# Altium schematic sheet ASCII_08_FPGA_banks_1_2_3_4.SchDoc: FPGA banks 1, 2, 3, 4
size A3; Organization: Lime Microsystems; Address1: Surrey Tech Centre; Address2: Guildford GU2 7YG; Address3: Surrey; Address4: United Kingdom; Revision: v1.4; SheetNumber: 8; SheetTotal: 15
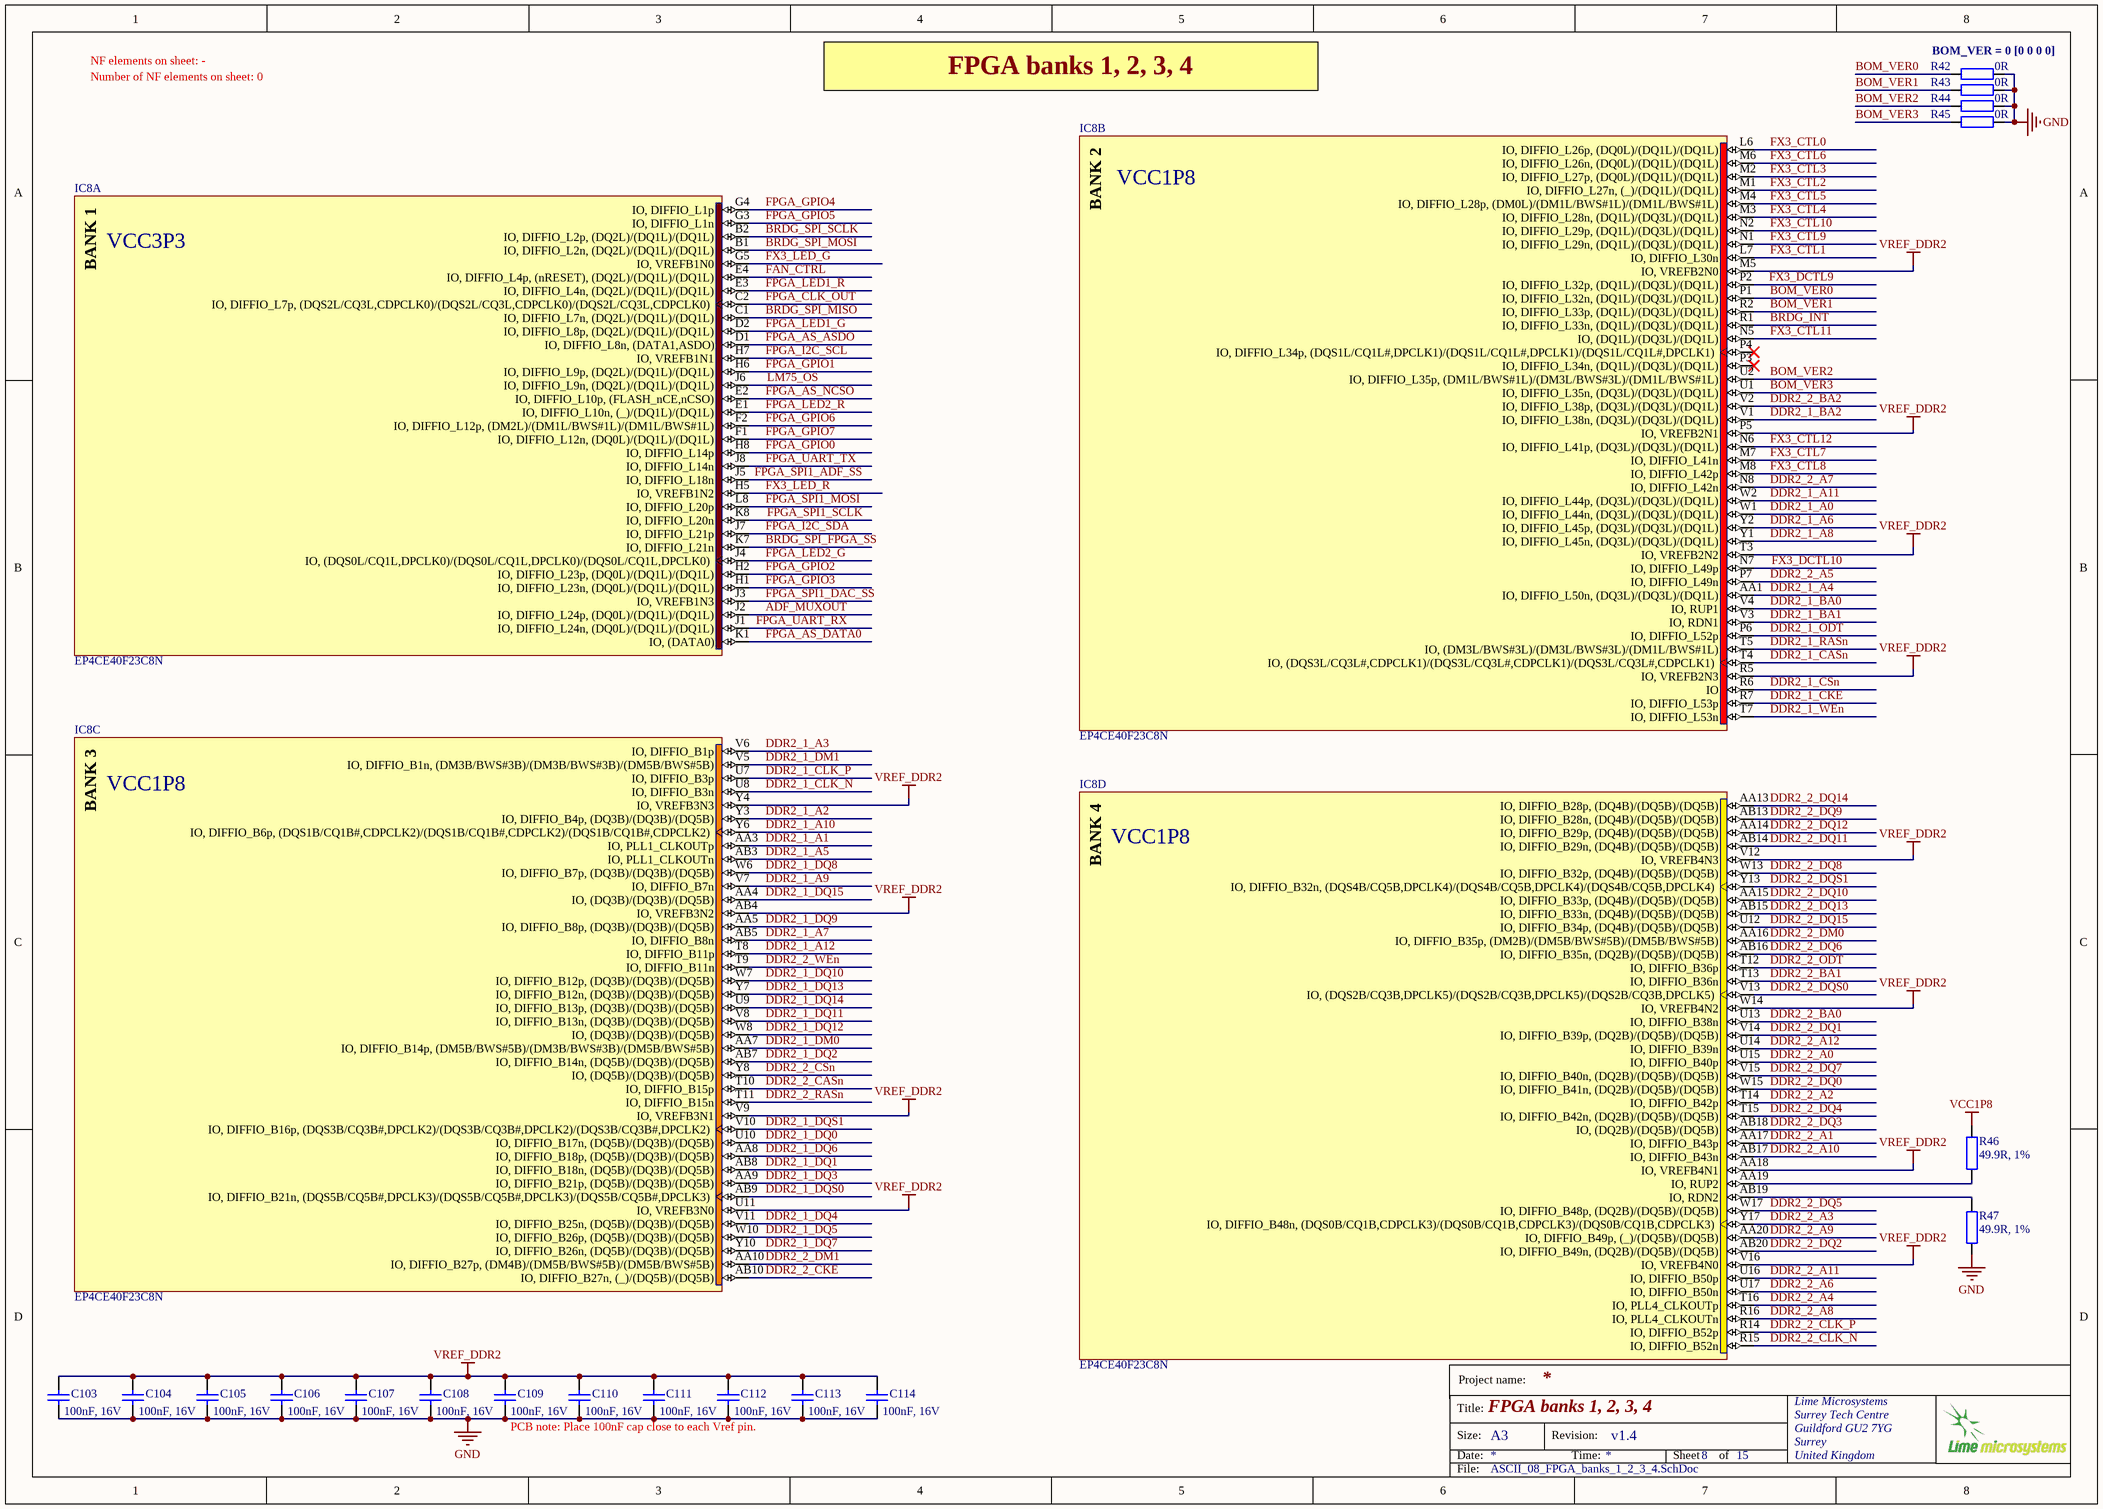
[diagram p0: ASCII_08_FPGA_banks_1_2_3_4.SchDoc]

## Parts
C103  100nF, 16V  [CAP0402]
C104  100nF, 16V  [CAP0402]
C105  100nF, 16V  [CAP0402]
C106  100nF, 16V  [CAP0402]
C107  100nF, 16V  [CAP0402]
C108  100nF, 16V  [CAP0402]
C109  100nF, 16V  [CAP0402]
C110  100nF, 16V  [CAP0402]
C111  100nF, 16V  [CAP0402]
C112  100nF, 16V  [CAP0402]
C113  100nF, 16V  [CAP0402]
C114  100nF, 16V  [CAP0402]
IC8  EP4CE40F23C8N  [FBGA484_A-240]  (parts A,B,C,D of 13)
R42  0R  [RES0402]
R43  0R  [RES0402]
R44  0R  [RES0402]
R45  0R  [RES0402]
R46  49.9R, 1%  [RES0402]
R47  49.9R, 1%  [RES0402]

## Nets
GND: C103.2 C104.2 C105.2 C106.2 C107.2 C108.2 C109.2 C110.2 C111.2 C112.2 C113.2 C114.2 R42.2 R43.2 R44.2 R45.2 R47.1
VCC1P8: R46.2
VREF_DDR2: C103.1 C104.1 C105.1 C106.1 C107.1 C108.1 C109.1 C110.1 C111.1 C112.1 C113.1 C114.1 IC8.AA18(IO,_VREFB4N1) IC8.AB4(IO,_VREFB3N2) IC8.M5(IO,_VREFB2N0) IC8.P5(IO,_VREFB2N1) IC8.R5(IO,_VREFB2N3) IC8.T3(IO,_VREFB2N2) IC8.U11(IO,_VREFB3N0) IC8.V9(IO,_VREFB3N1) IC8.V12(IO,_VREFB4N3) IC8.V16(IO,_VREFB4N0) IC8.W14(IO,_VREFB4N2) IC8.Y4(IO,_VREFB3N3)
ADF_MUXOUT: IC8.J2(IO,_DIFFIO_L24p,_(DQ0L)/(DQ1L)/(DQ1L))
BOM_VER0: IC8.P1(IO,_DIFFIO_L32n,_(DQ1L)/(DQ3L)/(DQ1L)) R42.1
BOM_VER1: IC8.R2(IO,_DIFFIO_L33p,_(DQ1L)/(DQ3L)/(DQ1L)) R43.1
BOM_VER2: IC8.U2(IO,_DIFFIO_L35p,_(DM1L/BWS#1L)/(DM3L/BWS#3L)/(DM1L/BWS#1L)) R44.1
BOM_VER3: IC8.U1(IO,_DIFFIO_L35n,_(DQ3L)/(DQ3L)/(DQ1L)) R45.1
BRDG_INT: IC8.R1(IO,_DIFFIO_L33n,_(DQ1L)/(DQ3L)/(DQ1L))
BRDG_SPI_FPGA_SS: IC8.K7(IO,_DIFFIO_L21n)
BRDG_SPI_MISO: IC8.C1(IO,_DIFFIO_L7n,_(DQ2L)/(DQ1L)/(DQ1L))
BRDG_SPI_MOSI: IC8.B1(IO,_DIFFIO_L2n,_(DQ2L)/(DQ1L)/(DQ1L))
BRDG_SPI_SCLK: IC8.B2(IO,_DIFFIO_L2p,_(DQ2L)/(DQ1L)/(DQ1L))
DDR2_1_A0: IC8.W1(IO,_DIFFIO_L44n,_(DQ3L)/(DQ3L)/(DQ1L))
DDR2_1_A1: IC8.AA3(IO,_PLL1_CLKOUTp)
DDR2_1_A2: IC8.Y3(IO,_DIFFIO_B4p,_(DQ3B)/(DQ3B)/(DQ5B))
DDR2_1_A3: IC8.V6(IO,_DIFFIO_B1p)
DDR2_1_A4: IC8.AA1(IO,_DIFFIO_L50n,_(DQ3L)/(DQ3L)/(DQ1L))
DDR2_1_A5: IC8.AB3(IO,_PLL1_CLKOUTn)
DDR2_1_A6: IC8.Y2(IO,_DIFFIO_L45p,_(DQ3L)/(DQ3L)/(DQ1L))
DDR2_1_A7: IC8.AB5(IO,_DIFFIO_B8n)
DDR2_1_A8: IC8.Y1(IO,_DIFFIO_L45n,_(DQ3L)/(DQ3L)/(DQ1L))
DDR2_1_A9: IC8.V7(IO,_DIFFIO_B7n)
DDR2_1_A10: IC8.Y6(IO,_DIFFIO_B6p,_(DQS1B/CQ1B#,CDPCLK2)/(DQS1B/CQ1B#,CDPCLK2)/(DQS1B/CQ1B#,CDPCLK2))
DDR2_1_A11: IC8.W2(IO,_DIFFIO_L44p,_(DQ3L)/(DQ3L)/(DQ1L))
DDR2_1_A12: IC8.T8(IO,_DIFFIO_B11p)
DDR2_1_BA0: IC8.V4(IO,_RUP1)
DDR2_1_BA1: IC8.V3(IO,_RDN1)
DDR2_1_BA2: IC8.V1(IO,_DIFFIO_L38n,_(DQ3L)/(DQ3L)/(DQ1L))
DDR2_1_CASn: IC8.T4(IO,_(DQS3L/CQ3L#,CDPCLK1)/(DQS3L/CQ3L#,CDPCLK1)/(DQS3L/CQ3L#,CDPCLK1))
DDR2_1_CKE: IC8.R7(IO,_DIFFIO_L53p)
DDR2_1_CLK_N: IC8.U8(IO,_DIFFIO_B3n)
DDR2_1_CLK_P: IC8.U7(IO,_DIFFIO_B3p)
DDR2_1_CSn: IC8.R6(IO)
DDR2_1_DM0: IC8.AA7(IO,_DIFFIO_B14p,_(DM5B/BWS#5B)/(DM3B/BWS#3B)/(DM5B/BWS#5B))
DDR2_1_DM1: IC8.V5(IO,_DIFFIO_B1n,_(DM3B/BWS#3B)/(DM3B/BWS#3B)/(DM5B/BWS#5B))
DDR2_1_DQ0: IC8.U10(IO,_DIFFIO_B17n,_(DQ5B)/(DQ3B)/(DQ5B))
DDR2_1_DQ1: IC8.AB8(IO,_DIFFIO_B18n,_(DQ5B)/(DQ3B)/(DQ5B))
DDR2_1_DQ2: IC8.AB7(IO,_DIFFIO_B14n,_(DQ5B)/(DQ3B)/(DQ5B))
DDR2_1_DQ3: IC8.AA9(IO,_DIFFIO_B21p,_(DQ5B)/(DQ3B)/(DQ5B))
DDR2_1_DQ4: IC8.V11(IO,_DIFFIO_B25n,_(DQ5B)/(DQ3B)/(DQ5B))
DDR2_1_DQ5: IC8.W10(IO,_DIFFIO_B26p,_(DQ5B)/(DQ3B)/(DQ5B))
DDR2_1_DQ6: IC8.AA8(IO,_DIFFIO_B18p,_(DQ5B)/(DQ3B)/(DQ5B))
DDR2_1_DQ7: IC8.Y10(IO,_DIFFIO_B26n,_(DQ5B)/(DQ3B)/(DQ5B))
DDR2_1_DQ8: IC8.W6(IO,_DIFFIO_B7p,_(DQ3B)/(DQ3B)/(DQ5B))
DDR2_1_DQ9: IC8.AA5(IO,_DIFFIO_B8p,_(DQ3B)/(DQ3B)/(DQ5B))
DDR2_1_DQ10: IC8.W7(IO,_DIFFIO_B12p,_(DQ3B)/(DQ3B)/(DQ5B))
DDR2_1_DQ11: IC8.V8(IO,_DIFFIO_B13n,_(DQ3B)/(DQ3B)/(DQ5B))
DDR2_1_DQ12: IC8.W8(IO,_(DQ3B)/(DQ3B)/(DQ5B))
DDR2_1_DQ13: IC8.Y7(IO,_DIFFIO_B12n,_(DQ3B)/(DQ3B)/(DQ5B))
DDR2_1_DQ14: IC8.U9(IO,_DIFFIO_B13p,_(DQ3B)/(DQ3B)/(DQ5B))
DDR2_1_DQ15: IC8.AA4(IO,_(DQ3B)/(DQ3B)/(DQ5B))
DDR2_1_DQS0: IC8.AB9(IO,_DIFFIO_B21n,_(DQS5B/CQ5B#,DPCLK3)/(DQS5B/CQ5B#,DPCLK3)/(DQS5B/CQ5B#,DPCLK3))
DDR2_1_DQS1: IC8.V10(IO,_DIFFIO_B16p,_(DQS3B/CQ3B#,DPCLK2)/(DQS3B/CQ3B#,DPCLK2)/(DQS3B/CQ3B#,DPCLK2))
DDR2_1_ODT: IC8.P6(IO,_DIFFIO_L52p)
DDR2_1_RASn: IC8.T5(IO,_(DM3L/BWS#3L)/(DM3L/BWS#3L)/(DM1L/BWS#1L))
DDR2_1_WEn: IC8.T7(IO,_DIFFIO_L53n)
DDR2_2_A0: IC8.U15(IO,_DIFFIO_B40p)
DDR2_2_A1: IC8.AA17(IO,_DIFFIO_B43p)
DDR2_2_A2: IC8.T14(IO,_DIFFIO_B42p)
DDR2_2_A3: IC8.Y17(IO,_DIFFIO_B48n,_(DQS0B/CQ1B,CDPCLK3)/(DQS0B/CQ1B,CDPCLK3)/(DQS0B/CQ1B,CDPCLK3))
DDR2_2_A4: IC8.T16(IO,_PLL4_CLKOUTp)
DDR2_2_A5: IC8.P7(IO,_DIFFIO_L49n)
DDR2_2_A6: IC8.U17(IO,_DIFFIO_B50n)
DDR2_2_A7: IC8.N8(IO,_DIFFIO_L42n)
DDR2_2_A8: IC8.R16(IO,_PLL4_CLKOUTn)
DDR2_2_A9: IC8.AA20(IO,_DIFFIO_B49p,_(_)/(DQ5B)/(DQ5B))
DDR2_2_A10: IC8.AB17(IO,_DIFFIO_B43n)
DDR2_2_A11: IC8.U16(IO,_DIFFIO_B50p)
DDR2_2_A12: IC8.U14(IO,_DIFFIO_B39n)
DDR2_2_BA0: IC8.U13(IO,_DIFFIO_B38n)
DDR2_2_BA1: IC8.T13(IO,_DIFFIO_B36n)
DDR2_2_BA2: IC8.V2(IO,_DIFFIO_L38p,_(DQ3L)/(DQ3L)/(DQ1L))
DDR2_2_CASn: IC8.T10(IO,_DIFFIO_B15p)
DDR2_2_CKE: IC8.AB10(IO,_DIFFIO_B27n,_(_)/(DQ5B)/(DQ5B))
DDR2_2_CLK_N: IC8.R15(IO,_DIFFIO_B52n)
DDR2_2_CLK_P: IC8.R14(IO,_DIFFIO_B52p)
DDR2_2_CSn: IC8.Y8(IO,_(DQ5B)/(DQ3B)/(DQ5B))
DDR2_2_DM0: IC8.AA16(IO,_DIFFIO_B35p,_(DM2B)/(DM5B/BWS#5B)/(DM5B/BWS#5B))
DDR2_2_DM1: IC8.AA10(IO,_DIFFIO_B27p,_(DM4B)/(DM5B/BWS#5B)/(DM5B/BWS#5B))
DDR2_2_DQ0: IC8.W15(IO,_DIFFIO_B41n,_(DQ2B)/(DQ5B)/(DQ5B))
DDR2_2_DQ1: IC8.V14(IO,_DIFFIO_B39p,_(DQ2B)/(DQ5B)/(DQ5B))
DDR2_2_DQ2: IC8.AB20(IO,_DIFFIO_B49n,_(DQ2B)/(DQ5B)/(DQ5B))
DDR2_2_DQ3: IC8.AB18(IO,_(DQ2B)/(DQ5B)/(DQ5B))
DDR2_2_DQ4: IC8.T15(IO,_DIFFIO_B42n,_(DQ2B)/(DQ5B)/(DQ5B))
DDR2_2_DQ5: IC8.W17(IO,_DIFFIO_B48p,_(DQ2B)/(DQ5B)/(DQ5B))
DDR2_2_DQ6: IC8.AB16(IO,_DIFFIO_B35n,_(DQ2B)/(DQ5B)/(DQ5B))
DDR2_2_DQ7: IC8.V15(IO,_DIFFIO_B40n,_(DQ2B)/(DQ5B)/(DQ5B))
DDR2_2_DQ8: IC8.W13(IO,_DIFFIO_B32p,_(DQ4B)/(DQ5B)/(DQ5B))
DDR2_2_DQ9: IC8.AB13(IO,_DIFFIO_B28n,_(DQ4B)/(DQ5B)/(DQ5B))
DDR2_2_DQ10: IC8.AA15(IO,_DIFFIO_B33p,_(DQ4B)/(DQ5B)/(DQ5B))
DDR2_2_DQ11: IC8.AB14(IO,_DIFFIO_B29n,_(DQ4B)/(DQ5B)/(DQ5B))
DDR2_2_DQ12: IC8.AA14(IO,_DIFFIO_B29p,_(DQ4B)/(DQ5B)/(DQ5B))
DDR2_2_DQ13: IC8.AB15(IO,_DIFFIO_B33n,_(DQ4B)/(DQ5B)/(DQ5B))
DDR2_2_DQ14: IC8.AA13(IO,_DIFFIO_B28p,_(DQ4B)/(DQ5B)/(DQ5B))
DDR2_2_DQ15: IC8.U12(IO,_DIFFIO_B34p,_(DQ4B)/(DQ5B)/(DQ5B))
DDR2_2_DQS0: IC8.V13(IO,_(DQS2B/CQ3B,DPCLK5)/(DQS2B/CQ3B,DPCLK5)/(DQS2B/CQ3B,DPCLK5))
DDR2_2_DQS1: IC8.Y13(IO,_DIFFIO_B32n,_(DQS4B/CQ5B,DPCLK4)/(DQS4B/CQ5B,DPCLK4)/(DQS4B/CQ5B,DPCLK4))
DDR2_2_ODT: IC8.T12(IO,_DIFFIO_B36p)
DDR2_2_RASn: IC8.T11(IO,_DIFFIO_B15n)
DDR2_2_WEn: IC8.T9(IO,_DIFFIO_B11n)
FAN_CTRL: IC8.E4(IO,_DIFFIO_L4p,_(nRESET),_(DQ2L)/(DQ1L)/(DQ1L))
FPGA_AS_ASDO: IC8.D1(IO,_DIFFIO_L8n,_(DATA1,ASDO))
FPGA_AS_DATA0: IC8.K1(IO,_(DATA0))
FPGA_AS_NCSO: IC8.E2(IO,_DIFFIO_L10p,_(FLASH_nCE,nCSO))
FPGA_CLK_OUT: IC8.C2(IO,_DIFFIO_L7p,_(DQS2L/CQ3L,CDPCLK0)/(DQS2L/CQ3L,CDPCLK0)/(DQS2L/CQ3L,CDPCLK0))
FPGA_GPIO0: IC8.H8(IO,_DIFFIO_L14p)
FPGA_GPIO1: IC8.H6(IO,_DIFFIO_L9p,_(DQ2L)/(DQ1L)/(DQ1L))
FPGA_GPIO2: IC8.H2(IO,_DIFFIO_L23p,_(DQ0L)/(DQ1L)/(DQ1L))
FPGA_GPIO3: IC8.H1(IO,_DIFFIO_L23n,_(DQ0L)/(DQ1L)/(DQ1L))
FPGA_GPIO4: IC8.G4(IO,_DIFFIO_L1p)
FPGA_GPIO5: IC8.G3(IO,_DIFFIO_L1n)
FPGA_GPIO6: IC8.F2(IO,_DIFFIO_L12p,_(DM2L)/(DM1L/BWS#1L)/(DM1L/BWS#1L))
FPGA_GPIO7: IC8.F1(IO,_DIFFIO_L12n,_(DQ0L)/(DQ1L)/(DQ1L))
FPGA_I2C_SCL: IC8.H7(IO,_VREFB1N1)
FPGA_I2C_SDA: IC8.J7(IO,_DIFFIO_L21p)
FPGA_LED1_G: IC8.D2(IO,_DIFFIO_L8p,_(DQ2L)/(DQ1L)/(DQ1L))
FPGA_LED1_R: IC8.E3(IO,_DIFFIO_L4n,_(DQ2L)/(DQ1L)/(DQ1L))
FPGA_LED2_G: IC8.J4(IO,_(DQS0L/CQ1L,DPCLK0)/(DQS0L/CQ1L,DPCLK0)/(DQS0L/CQ1L,DPCLK0))
FPGA_LED2_R: IC8.E1(IO,_DIFFIO_L10n,_(_)/(DQ1L)/(DQ1L))
FPGA_SPI1_ADF_SS: IC8.J5(IO,_DIFFIO_L18n)
FPGA_SPI1_DAC_SS: IC8.J3(IO,_VREFB1N3)
FPGA_SPI1_MOSI: IC8.L8(IO,_DIFFIO_L20p)
FPGA_SPI1_SCLK: IC8.K8(IO,_DIFFIO_L20n)
FPGA_UART_RX: IC8.J1(IO,_DIFFIO_L24n,_(DQ0L)/(DQ1L)/(DQ1L))
FPGA_UART_TX: IC8.J8(IO,_DIFFIO_L14n)
FX3_CTL0: IC8.L6(IO,_DIFFIO_L26p,_(DQ0L)/(DQ1L)/(DQ1L))
FX3_CTL1: IC8.L7(IO,_DIFFIO_L30n)
FX3_CTL2: IC8.M1(IO,_DIFFIO_L27n,_(_)/(DQ1L)/(DQ1L))
FX3_CTL3: IC8.M2(IO,_DIFFIO_L27p,_(DQ0L)/(DQ1L)/(DQ1L))
FX3_CTL4: IC8.M3(IO,_DIFFIO_L28n,_(DQ1L)/(DQ3L)/(DQ1L))
FX3_CTL5: IC8.M4(IO,_DIFFIO_L28p,_(DM0L)/(DM1L/BWS#1L)/(DM1L/BWS#1L))
FX3_CTL6: IC8.M6(IO,_DIFFIO_L26n,_(DQ0L)/(DQ1L)/(DQ1L))
FX3_CTL7: IC8.M7(IO,_DIFFIO_L41n)
FX3_CTL8: IC8.M8(IO,_DIFFIO_L42p)
FX3_CTL9: IC8.N1(IO,_DIFFIO_L29n,_(DQ1L)/(DQ3L)/(DQ1L))
FX3_CTL10: IC8.N2(IO,_DIFFIO_L29p,_(DQ1L)/(DQ3L)/(DQ1L))
FX3_CTL11: IC8.N5(IO,_(DQ1L)/(DQ3L)/(DQ1L))
FX3_CTL12: IC8.N6(IO,_DIFFIO_L41p,_(DQ3L)/(DQ3L)/(DQ1L))
FX3_DCTL9: IC8.P2(IO,_DIFFIO_L32p,_(DQ1L)/(DQ3L)/(DQ1L))
FX3_DCTL10: IC8.N7(IO,_DIFFIO_L49p)
FX3_LED_G: IC8.G5(IO,_VREFB1N0)
FX3_LED_R: IC8.H5(IO,_VREFB1N2)
LM75_OS: IC8.J6(IO,_DIFFIO_L9n,_(DQ2L)/(DQ1L)/(DQ1L))
NetIC8_AA19: IC8.AA19(IO,_RUP2) R46.1
NetIC8_AB19: IC8.AB19(IO,_RDN2) R47.2

Not connected (* = marked no-connect by the designer): IC8 P3(IO,_DIFFIO_L34n,_(DQ1L)/(DQ3L)/(DQ1L))* P4(IO,_DIFFIO_L34p,_(DQS1L/CQ1L#,DPCLK1)/(DQS1L/CQ1L#,DPCLK1)/(DQS1L/CQ1L#,DPCLK1))*

## Notes on the sheet
- NF elements on sheet: -
- Number of NF elements on sheet: 0
- FPGA banks 1, 2, 3, 4
- (near R42) BOM_VER = 0 [0 0 0 0]
- VCC3P3
- VCC1P8
- PCB note: Place 100nF cap close to each Vref pin.
- Project name:
- Title:
- Size:
- Date:
- A3
- Revision:
- Time:
- Sheet
- of
- File:
- (in symbol EP4CE40F23C7N, part A) BANK 1
- (in symbol EP4CE40F23C7N, part B) BANK 2
- (in symbol EP4CE40F23C7N, part C) BANK 3
- (in symbol EP4CE40F23C7N, part D) BANK 4

## Library data of the parts
C103-C114 = Cap_0603: Manufacturer Part Number 1: GRM155R71C104KA88D; Part Description: 0.10µF ±10% 16V X7R Ceramic Capacitor -55°C ~ 125°C Surface Mount, MLCC 0402 (1005 Metric) 0.039" L x 0.020" W (1.00mm x 0.50mm); Brand: Murata Electronics; Tolerance: 10 %; Type: General Purpose MLCC; Capacitance: 0.1 uF; Temperature Coefficient / Code: +/- 15 %; Supplier 1: Mouser; Supplier Part Number 1: 81-GRM155R71C104KA88; Case Code - in: 0402; Manufacturer: Murata Electronics; Category: Multilayer Ceramic Capacitors MLCC - SMD/SMT; Voltage Rating DC: 16 V; Value: 100nF, 16V; Manufacturer Part Number: GRM155R71C104KA88D
IC8 = EP4CE40F23C7N: IC FPGA 328 I/O 484FBGA; Manufacturer: Altera; Number of I/O: 328; Number of LABs/CLBs: 2475; Number of Logic Elements/Cells: 39600; Total RAM Bits: 1161216; Voltage - Supply: 1.15 V ~ 1.25 V; DatasheetVersion: ver1.6, Nov-2011; PackageDescription: 484-Pin FineLine Ball Grid Array (FBGA) - Wire Bond - A:2.40; Code_JEDEC: MS-034-AAJ-1; ComponentLink1Description: Manufacturer URL; ComponentLink1URL: http://www.altera.com/; ComponentLink2Description: Handbook; ComponentLink2URL: http://www.altera.com/literature/hb/cyclone-iv/cyclone4-handbook.pdf; ComponentLink3Description: Pinout; ComponentLink3URL: http://www.altera.com/literature/lit-dp.jsp?category=cyc%204&showspreadsheet=y; ComponentLink4Description: Package Specification; ComponentLink4URL: http://www.altera.com/devicepackaging/04R00247-02.pdf; Category: Integrated Circuits (ICs); Manufacturer Part Number 1: EP4CE40F23C8N; Mounting Type: Surface Mount; Number of Gates: -; Operating Temperature: 0°C ~ 85°C; Package / Case: 484-BGA; RoHS: RoHS Compliant; Supplier 1: Digi-Key; Supplier Device Package: 484-FBGA (23x23); Supplier Part Number 1: 544-2811-ND; Part Description: IC FPGA 328 I/O 484FBGA
R42-R45 = Res_0402: Manufacturer: Yageo; Part Description: RES SMD 0.0OHM JUMPER 1/16W 0402; Supplier 1: Digi-Key; Supplier Part Number 1: 311-0.0JRTR-ND; Composition: Thick Film; Package / Case: 0402 (1005 Metric); Category: Resistors; Value: 0R
R46 R47 = Res_0402: Manufacturer: Samsung Electro-Mechanics America, Inc.; Manufacturer Part Number: RC1005F49R9CS; Part Description: RES SMD 49.9 OHM 1% 1/16W 0402; Temperature Coefficient: ±100ppm/°C; Resistance (Ohms): 49.9; Power (Watts): 0.063W, 1/16W; Number of Terminations: 2; Size / Dimension: 0.039" L x 0.020" W (1.00mm x 0.50mm); Supplier Device Package: 0402 (1005 Metric); RoHS: RoHS Compliant; Supplier Part Number 1: 1276-3469-6-ND; Features: -; Packaging: Digi-Reel®; Tolerance: ±1%; Height: 0.016" (0.40mm); Category: Resistors; Composition: Thick Film; Package / Case: 0402 (1005 Metric); Supplier 1: Digi-Key; Operating Temperature: -55°C ~ 155°C; Value: 49.9R, 1%